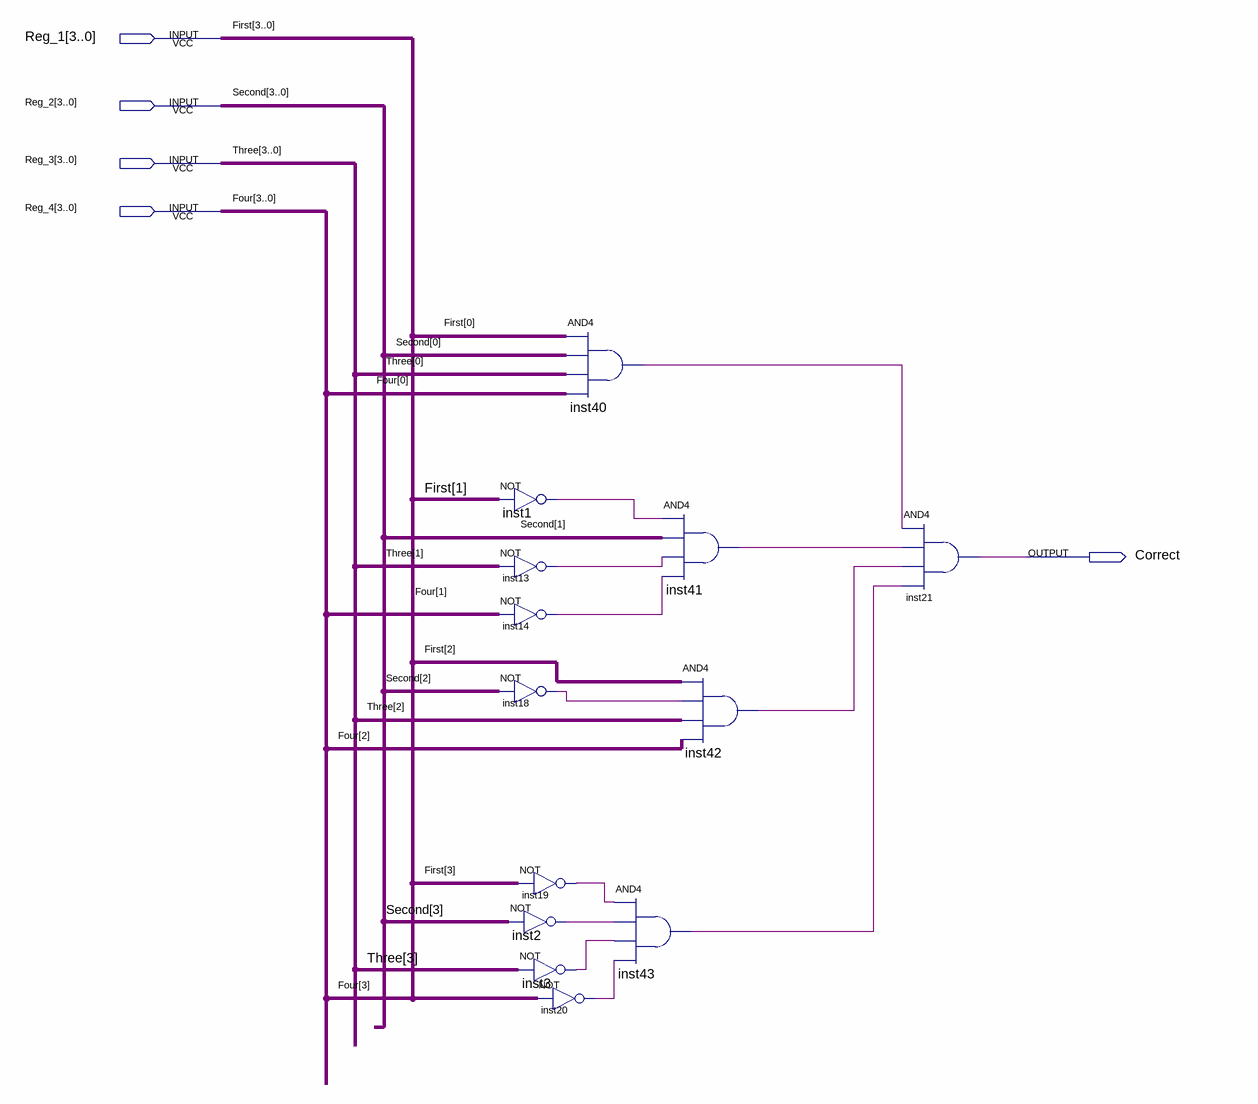
[diagram p0: schematic sheet]
// Quartus schematic Password.bdf as structural Verilog: 13 symbols, 5 pins
module Password (
  input  [3:0] Reg_1,
  input  [3:0] Reg_2,
  input  [3:0] Reg_3,
  input  [3:0] Reg_4,
  output Correct
);

  wire inst1_out, inst2_out, inst3_out, inst13_out, inst14_out, inst18_out, inst19_out, inst20_out,
       inst40_out, inst41_out, inst42_out, inst43_out;

  not inst1 (inst1_out, Reg_1[1]);
  not inst13 (inst13_out, Reg_3[1]);
  not inst14 (inst14_out, Reg_4[1]);
  not inst18 (inst18_out, Reg_2[2]);
  not inst2 (inst2_out, Reg_2[3]);
  and inst40 (inst40_out, Reg_1[0], Reg_2[0], Reg_3[0], Reg_4[0]);
  not inst19 (inst19_out, Reg_1[3]);
  not inst3 (inst3_out, Reg_3[3]);
  assign inst20_out = ~Reg_1;  // NOT inst20, 4 bits wide
  and inst41 (inst41_out, inst1_out, Reg_2[1], inst13_out, inst14_out);
  and inst43 (inst43_out, inst19_out, inst2_out, inst3_out, inst20_out);
  and inst42 (inst42_out, Reg_1[2], inst18_out, Reg_3[2], Reg_4[2]);
  and inst21 (Correct, inst40_out, inst41_out, inst42_out, inst43_out);

  // Other names for the same wires on the sheet: First[3:0] = Reg_1; Four[3:0] = Reg_4; Second[3:0] = Reg_2;
  //   Three[3:0] = Reg_3
endmodule
